# EAGLE design Mainboard (EAGLE 9.2.0)
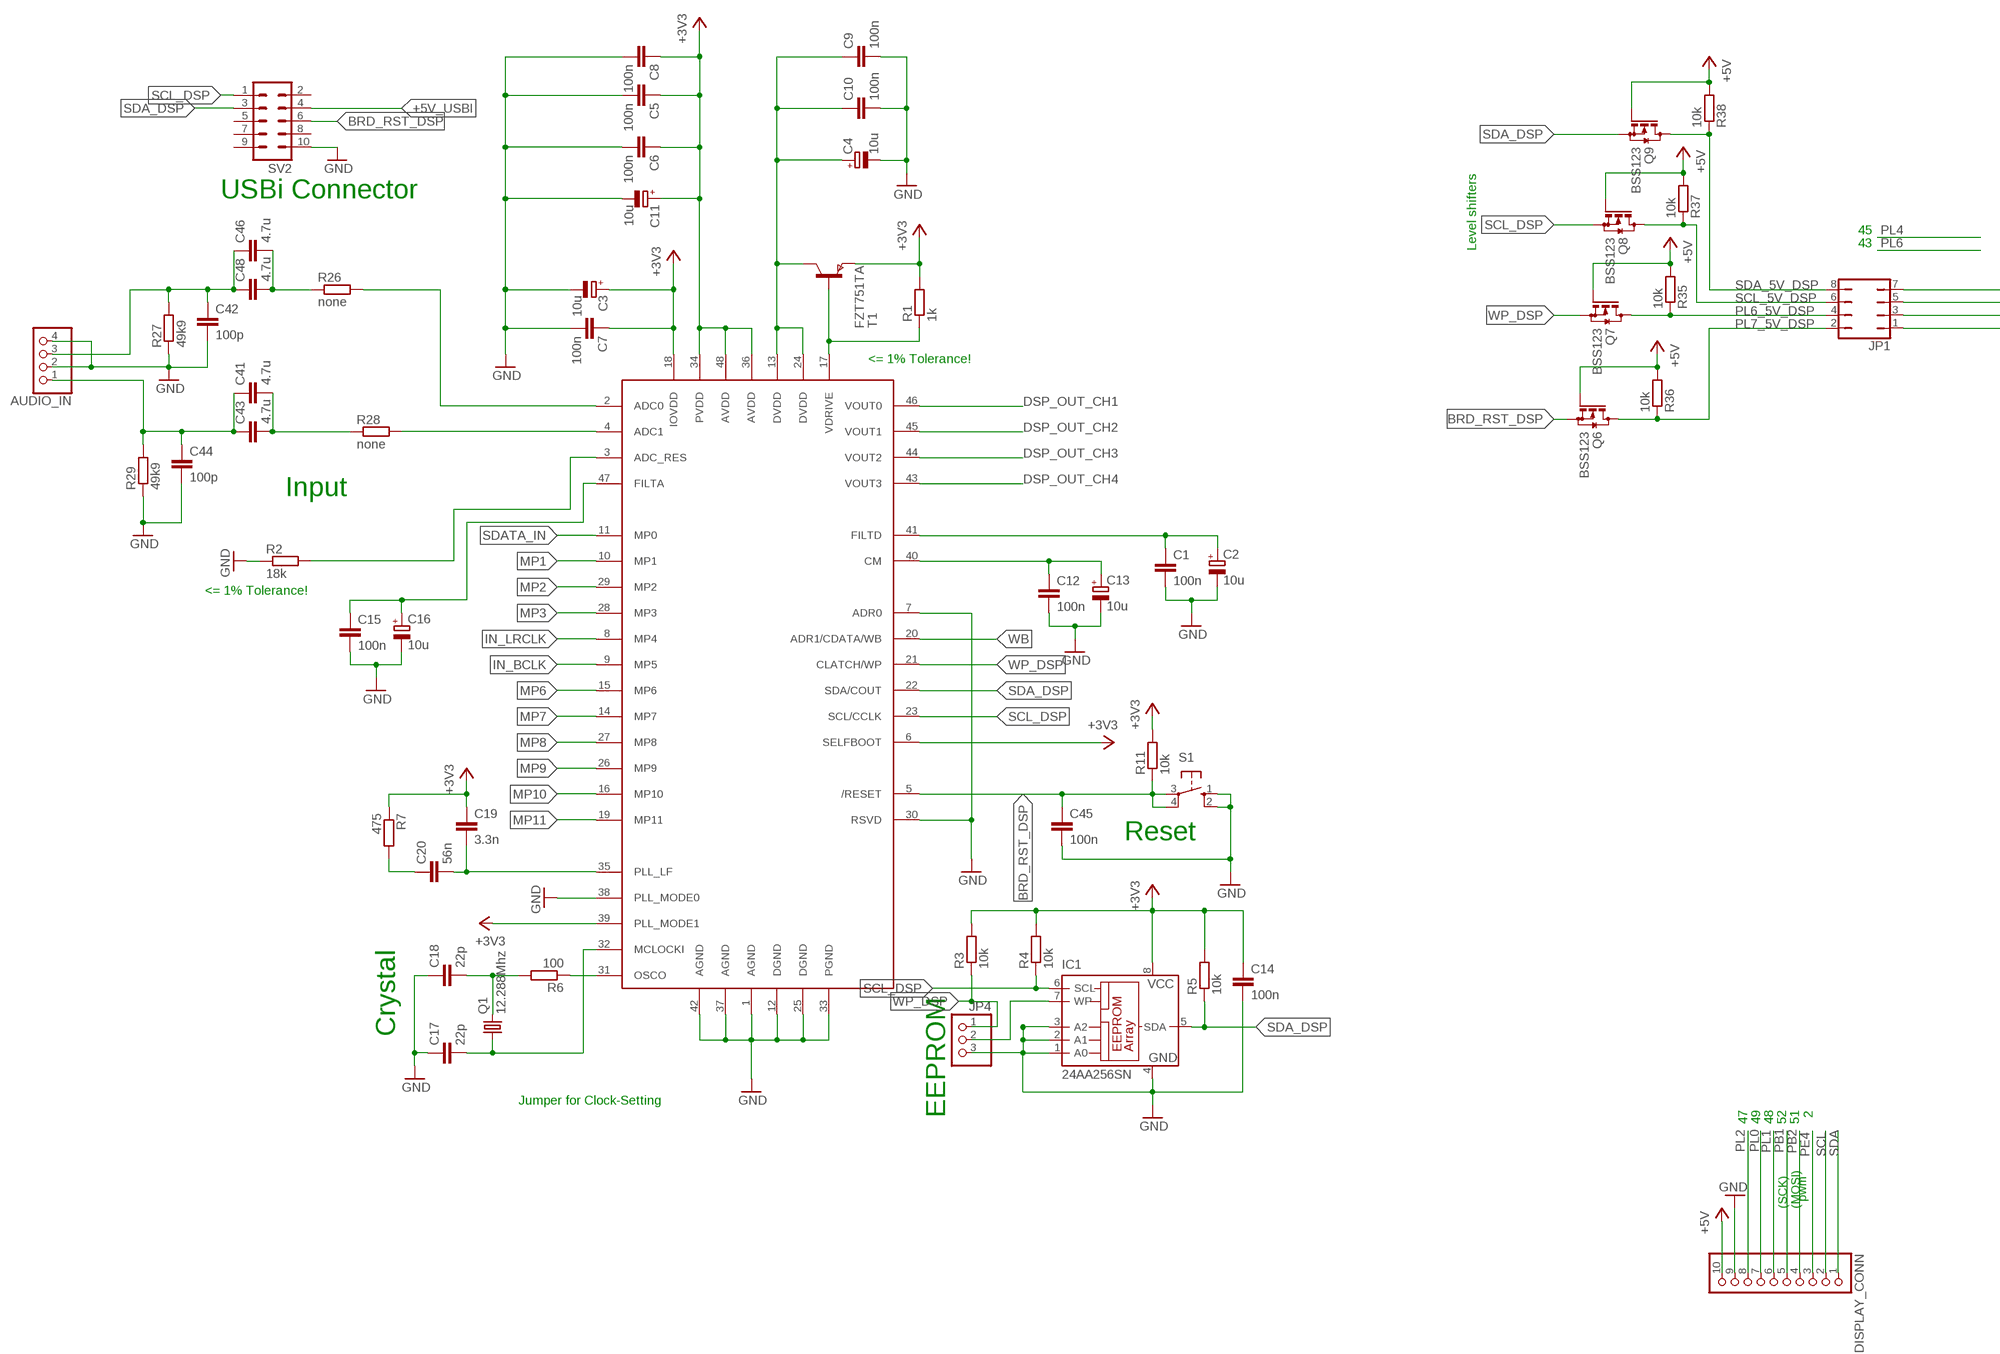
[diagram p0: schematic, sheet 1, part 1 of 3]
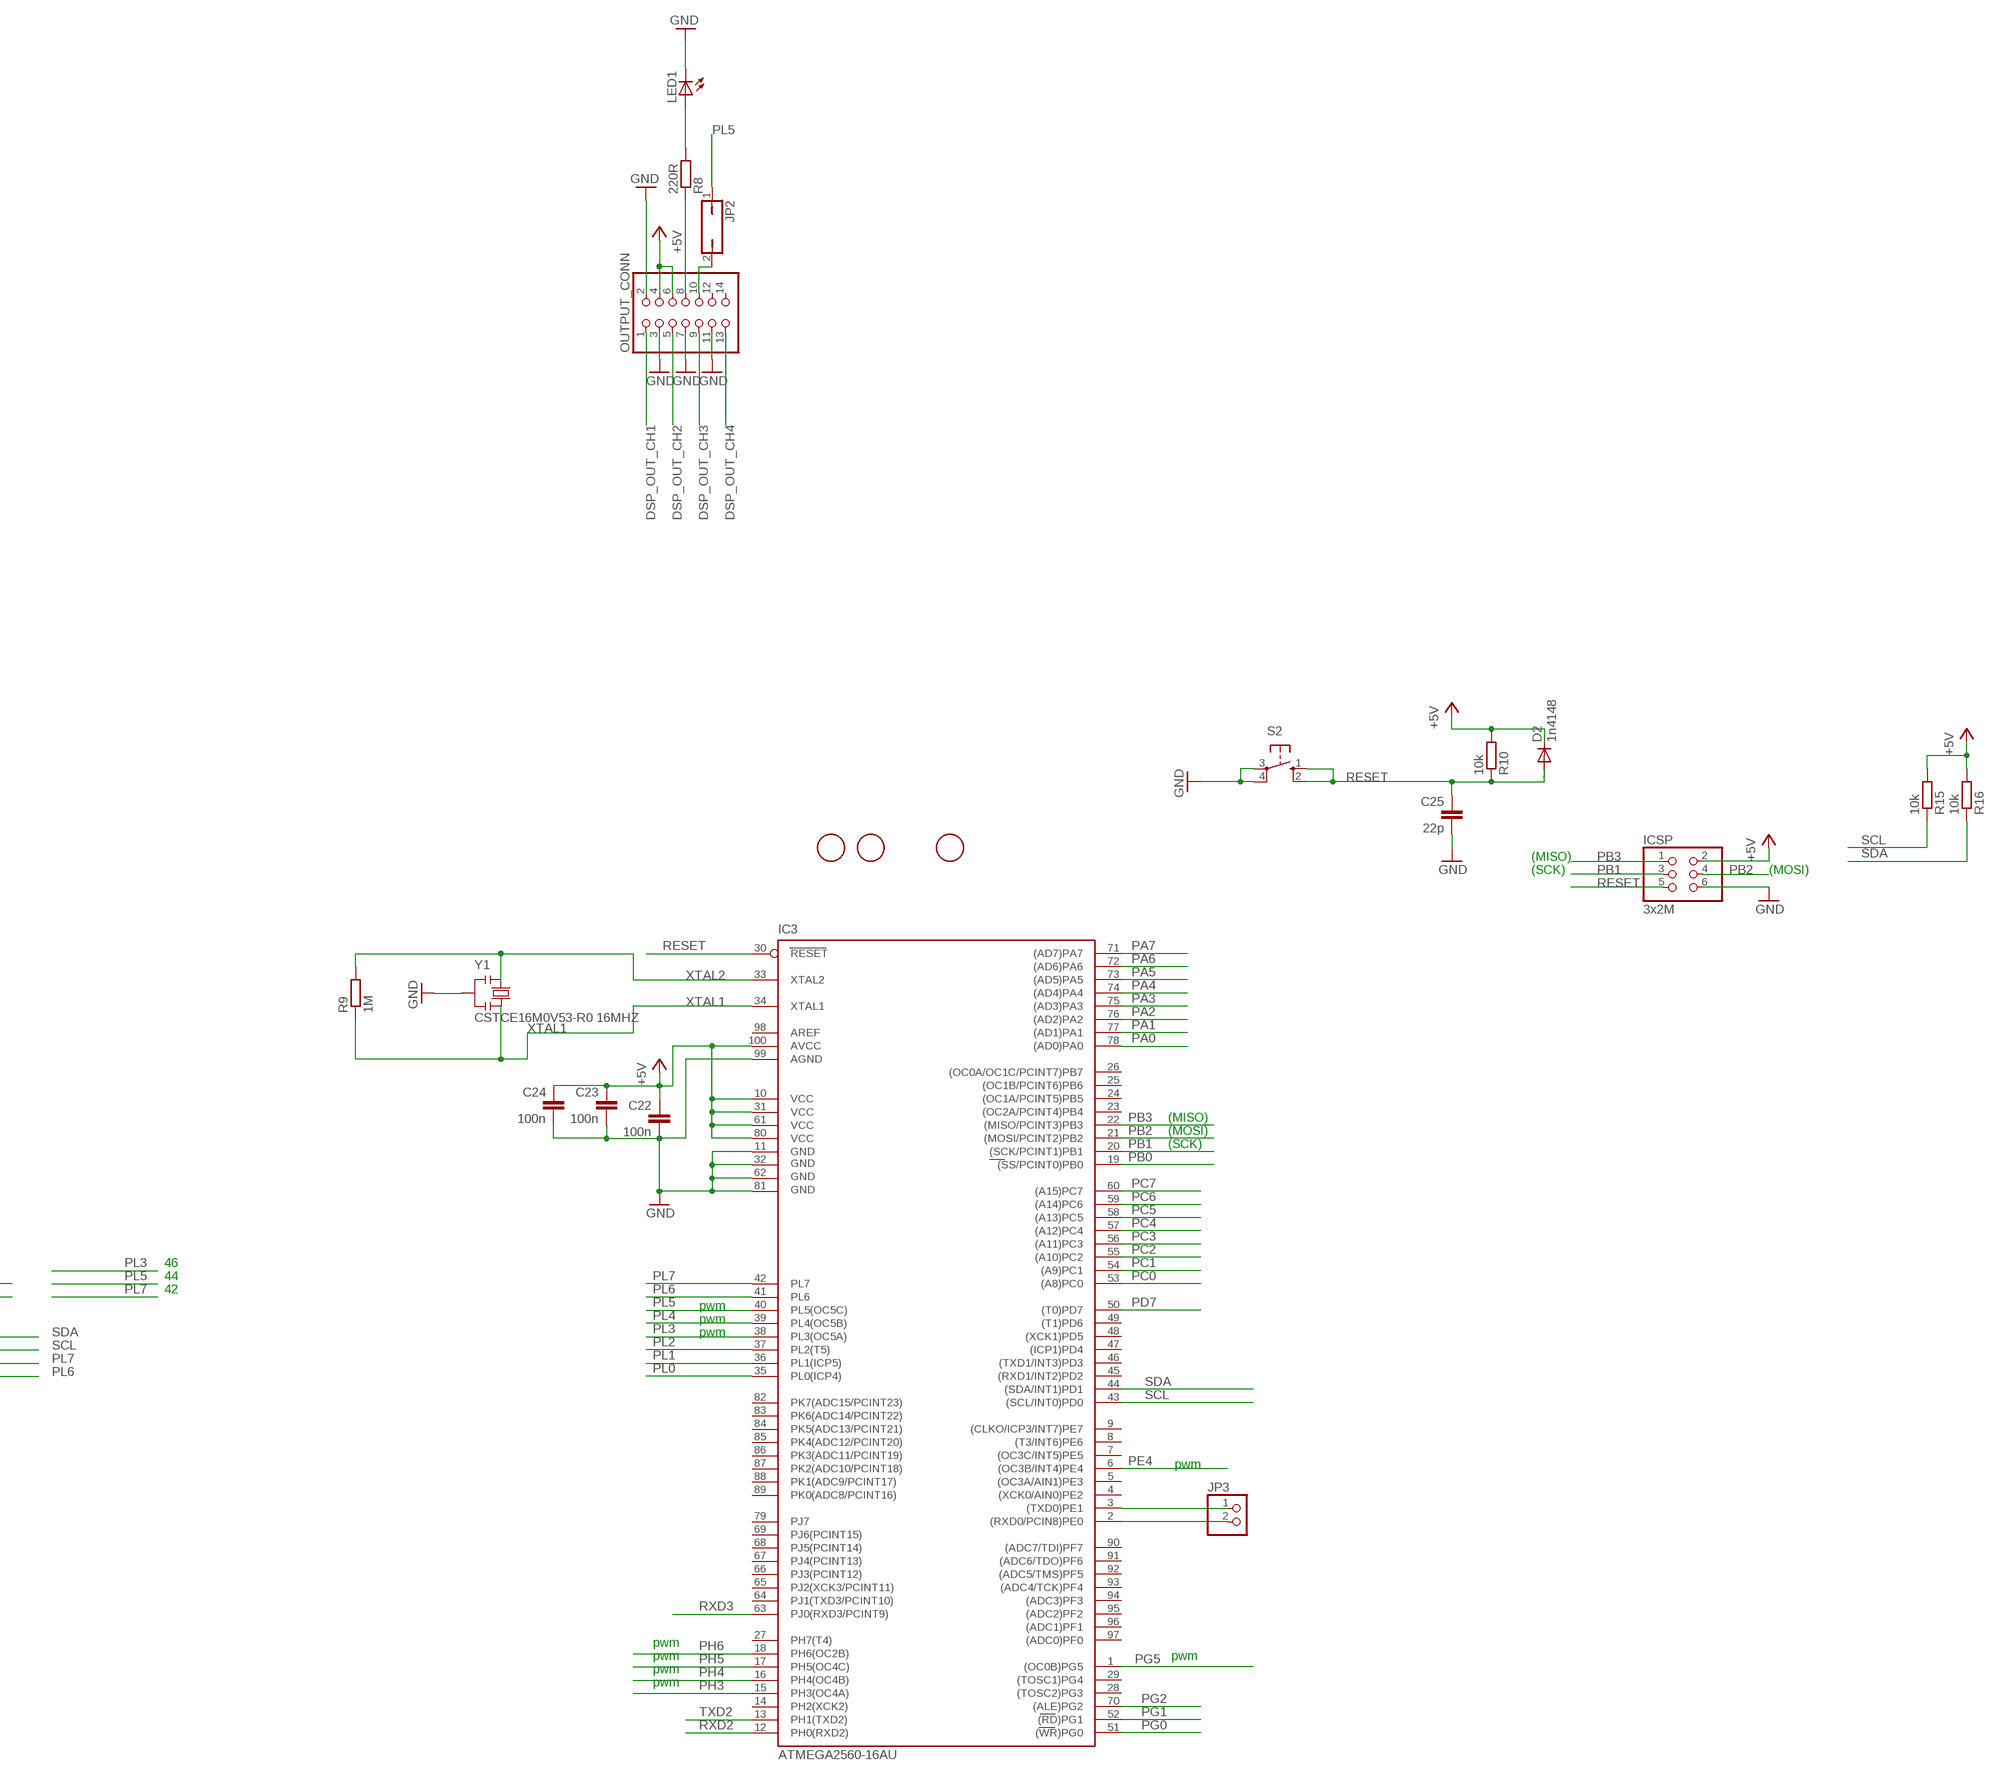
[diagram p1: schematic, sheet 1, part 2 of 3]
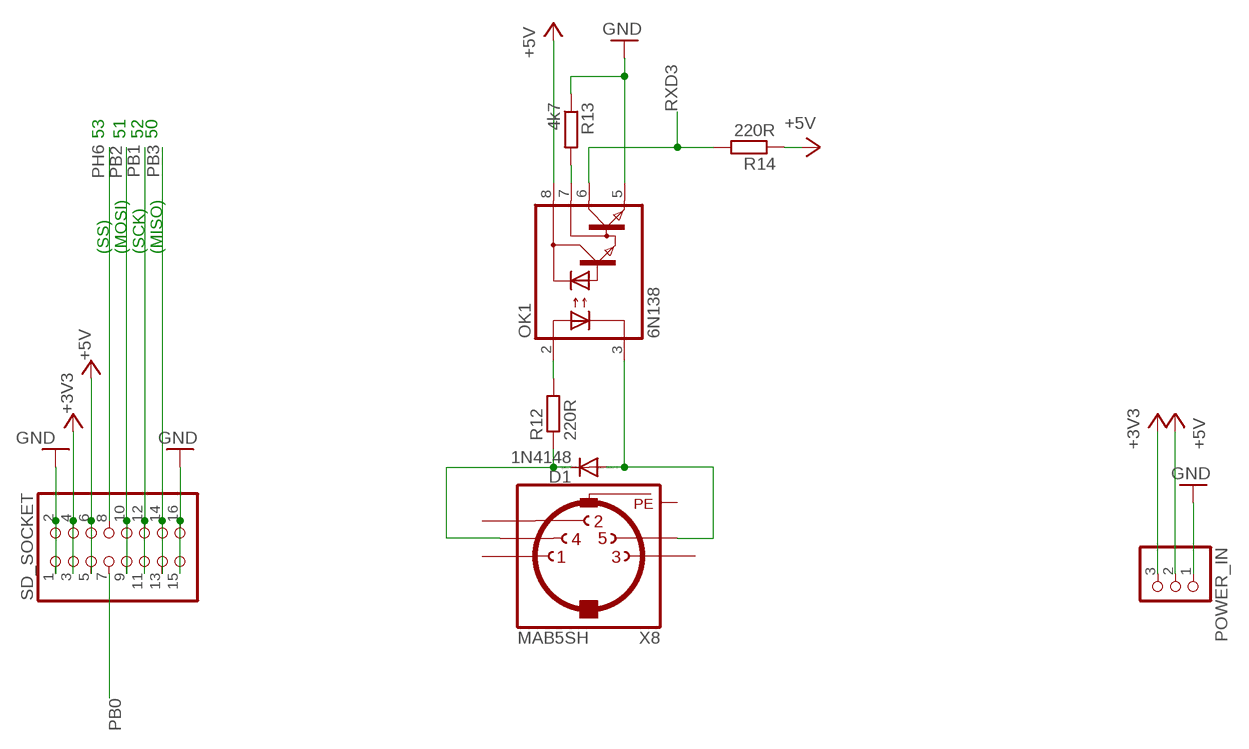
[diagram p2: schematic, sheet 1, part 3 of 3]

## Parts
AUDIO_IN  PINHD-1X4  [1X04]
C1  100n  C-EUC0805K  [C0805K]
C2  10u  CPOL-EUE1.8-4  [E1,8-4]
C3  10u  CPOL-EUE1.8-4  [E1,8-4]
C4  10u  CPOL-EUE1.8-4  [E1,8-4]
C5  100n  C-EUC0805K  [C0805K]
C6  100n  C-EUC0805K  [C0805K]
C7  100n  C-EUC0805K  [C0805K]
C8  100n  C-EUC0805K  [C0805K]
C9  100n  C-EUC0805K  [C0805K]
C10  100n  C-EUC0805K  [C0805K]
C11  10u  CPOL-EUE1.8-4  [E1,8-4]
C12  100n  C-EUC0805K  [C0805K]
C13  10u  CPOL-EUE1.8-4  [E1,8-4]
C14  100n  C-EUC0805K  [C0805K]
C15  100n  C-EUC0805K  [C0805K]
C16  10u  CPOL-EUE1.8-4  [E1,8-4]
C17  22p  C-EUC0805K  [C0805K]
C18  22p  C-EUC0805K  [C0805K]
C19  3.3n  C-EUC0805K  [C0805K]
C20  56n  C-EUC0805K  [C0805K]
C22  100n  C-EUC0805K  [C0805K]
C23  100n  C-EUC0805K  [C0805K]
C24  100n  C-EUC0805K  [C0805K]
C25  22p  C-EUC0805K  [C0805K]
C41  4.7u  C-EU050-075X075  [C050-075X075]
C42  100p  C-EUC0805K  [C0805K]
C43  4.7u  C-EU050-075X075  [C050-075X075]
C44  100p  C-EUC0805K  [C0805K]
C45  100n  C-EUC0805K  [C0805K]
C46  4.7u  C-EU050-075X075  [C050-075X075]
C48  4.7u  C-EU050-075X075  [C050-075X075]
D1  1N4148  CGRM4001-G  [SOD-123_MINI-SMA]
D2  1n4148  CGRM4001-G  [SOD-123_MINI-SMA]
DISPLAY_CONN  PINHD-1X10  [1X10]
FD1  FIDUCIALMOUNT  [FIDUCIA-MOUNT]
FD2  FIDUCIALMOUNT  [FIDUCIA-MOUNT]
FD4  FIDUCIALMOUNT  [FIDUCIA-MOUNT]
IC1  24AA256SN  [SO-08]
IC3  ATMEGA2560-16AU  ATMEGA25602560-16AU  [TQFP100]
ICSP  3x2M  PINHD-2X3  [2X03]
JP1  JP4Q  [JP4Q]
JP2  JP1Q  [JP1]
JP3  PINHD-1X2  [1X02]
JP4  PINHD-1X3  [1X03]
LED1  LED5MM  [LED5MM]
OK1  6N138  [DIL08]
OUTPUT_CONN  PINHD-2X7  [2X07]
POWER_IN  PINHD-1X3  [1X03]
Q1  12.288Mhz  CRYSTALHC49S  [HC49/S]
Q6  BSS123  [SOT23]
Q7  BSS123  [SOT23]
Q8  BSS123  [SOT23]
Q9  BSS123  [SOT23]
R1  1k  R-EU_R0805  [R0805]
R2  18k  R-EU_R0805  [R0805]
R3  10k  R-EU_R0805  [R0805]
R4  10k  R-EU_R0805  [R0805]
R5  10k  R-EU_R0805  [R0805]
R6  100  R-EU_R0805  [R0805]
R7  475  R-EU_R0805  [R0805]
R8  220R  R-EU_R0805  [R0805]
R9  1M  R-EU_R0805  [R0805]
R10  10k  R-EU_R0805  [R0805]
R11  10k  R-EU_R0805  [R0805]
R12  220R  R-EU_R0805  [R0805]
R13  4k7  R-EU_R0805  [R0805]
R14  220R  R-EU_R0805  [R0805]
R15  10k  R-EU_R0805  [R0805]
R16  10k  R-EU_R0805  [R0805]
R26  none  R-EU_R0805  [R0805]
R27  49k9  R-EU_R0805  [R0805]
R28  none  R-EU_R0805  [R0805]
R29  49k9  R-EU_R0805  [R0805]
R35  10k  R-EU_R0805  [R0805]
R36  10k  R-EU_R0805  [R0805]
R37  10k  R-EU_R0805  [R0805]
R38  10k  R-EU_R0805  [R0805]
S1  10-XX  [B3F-10XX]
S2  10-XX  [B3F-10XX]
SD_SOCKET  PINHD-2X8  [2X08]
SV2  ML10  [ML10]
T1  FZT751TA  FZT789A  [SOT223]
U$1  ADAU1701  [LQFP-48]
X8  MAB5SH  [MAB5SH]
Y1  CSTCE16M0V53-R0 16MHZ  RESONATORMU  [RESONATOR]

## Nets
1V8_DSP: C4.+ C9.1 C10.1 T1.2(C) T1.4(C) U$1.13(DVDD) U$1.24(DVDD)
+3V3: C3.+ C5.1 C6.1 C7.1 C8.1 C11.+ C14.1 C19.1 IC1.8(VCC) POWER_IN.3 R1.2 R3.2 R4.2 R5.2 R7.1 R11.2 SD_SOCKET.3 SD_SOCKET.4 T1.3(E) U$1.6(SELFBOOT) U$1.18(IOVDD) U$1.34(PVDD) U$1.36(AVDD) U$1.39(PLL_MODE1) U$1.48(AVDD)
+5V: C22.1 C23.1 C24.1 D2.C DISPLAY_CONN.10 IC3.10(VCC) IC3.31(VCC1) IC3.61(VCC2) IC3.80(VCC3) IC3.100(AVCC) ICSP.2 OK1.8(VCC) OUTPUT_CONN.4 OUTPUT_CONN.6 POWER_IN.2 Q6.1(G) Q7.1(G) Q8.1(G) Q9.1(G) R10.2 R14.1 R15.2 R16.2 R35.2 R36.2 R37.2 R38.2 SD_SOCKET.5 SD_SOCKET.6
+5V_USBI: SV2.4
ADC0: R28.2 U$1.4(ADC1)
BRD_RST_DSP: C45.1 Q6.2(S) R11.1 S1.3(P) S1.4(P1) SV2.6 U$1.5(/RESET)
CM: C12.1 C13.+ U$1.40(CM)
DSP_OUT_CH1: OUTPUT_CONN.1 U$1.46(VOUT0)
DSP_OUT_CH2: OUTPUT_CONN.5 U$1.45(VOUT1)
DSP_OUT_CH3: OUTPUT_CONN.9 U$1.44(VOUT2)
DSP_OUT_CH4: OUTPUT_CONN.13 U$1.43(VOUT3)
FILTA: C15.1 C16.+ U$1.47(FILTA)
FILTD: C1.1 C2.+ U$1.41(FILTD)
GND: AUDIO_IN.2 AUDIO_IN.4 C1.2 C2.- C3.- C4.- C5.2 C6.2 C7.2 C8.2 C9.2 C10.2 C11.- C12.2 C13.- C14.2 C15.2 C16.- C17.1 C18.1 C22.2 C23.2 C24.2 C25.2 C42.2 C44.2 C45.2 DISPLAY_CONN.9 IC1.1(A0) IC1.2(A1) IC1.3(A2) IC1.4(GND) IC3.11(GND) IC3.32(GND1) IC3.62(GND2) IC3.81(GND3) IC3.99(AGND) ICSP.6 JP4.3 LED1.K(C) OK1.5(GND) OUTPUT_CONN.2 OUTPUT_CONN.3 OUTPUT_CONN.7 OUTPUT_CONN.11 POWER_IN.1 R2.1 R13.1 R27.1 R29.1 S1.1(S) S1.2(S1) S2.3(P) S2.4(P1) SD_SOCKET.1 SD_SOCKET.2 SD_SOCKET.15 SD_SOCKET.16 SV2.10 U$1.1(AGND) U$1.7(ADR0) U$1.12(DGND) U$1.25(DGND) U$1.30(RSVD) U$1.33(PGND) U$1.37(AGND) U$1.38(PLL_MODE0) U$1.42(AGND) Y1.2
IN_BCLK: U$1.9(MP5)
IN_LRCLK: U$1.8(MP4)
MP1: U$1.10(MP1)
MP2: U$1.29(MP2)
MP3: U$1.28(MP3)
MP6: U$1.15(MP6)
MP7: U$1.14(MP7)
MP8: U$1.27(MP8)
MP9: U$1.26(MP9)
MP10: U$1.16(MP10)
MP11: U$1.19(MP11)
N$1: R2.2 U$1.3(ADC_RES)
N$2: R1.1 T1.1(B) U$1.17(VDRIVE)
N$3: C19.2 C20.2 U$1.35(PLL_LF)
N$4: OUTPUT_CONN.8 R8.1
N$5: C20.1 R7.2
N$6: C18.2 Q1.2 R6.2
N$7: C17.2 Q1.1 U$1.32(MCLOCKI)
N$8: R6.1 U$1.31(OSCO)
N$9: LED1.A R8.2
N$10: JP2.2 OUTPUT_CONN.10
N$11: IC3.3((TXD0)PE1) JP3.1
N$12: IC3.2((RXD0/PCIN8)PE0) JP3.2
N$13: OK1.2(A) R12.2
N$15: D1.C R12.1 X8.4
N$16: D1.A OK1.3(C) X8.5
N$17: OK1.7(VB) R13.2
N$30: C46.2 C48.2 R26.1
N$31: AUDIO_IN.3 C42.1 C46.1 C48.1 R27.2
N$34: AUDIO_IN.1 C41.1 C43.1 C44.1 R29.2
N$36: C41.2 C43.2 R28.1
N$40: R26.2 U$1.2(ADC0)
N$43: IC1.7(WP) JP4.2
PA0: IC3.78((AD0)PA0)
PA1: IC3.77((AD1)PA1)
PA2: IC3.76((AD2)PA2)
PA3: IC3.75((AD3)PA3)
PA4: IC3.74((AD4)PA4)
PA5: IC3.73((AD5)PA5)
PA6: IC3.72((AD6)PA6)
PA7: IC3.71((AD7)PA7)
PB0: IC3.19((SS/PCINT0)PB0) SD_SOCKET.7
PB1: DISPLAY_CONN.5 IC3.20((SCK/PCINT1)PB1) ICSP.3 SD_SOCKET.11 SD_SOCKET.12
PB2: DISPLAY_CONN.4 IC3.21((MOSI/PCINT2)PB2) ICSP.4 SD_SOCKET.9 SD_SOCKET.10
PB3: IC3.22((MISO/PCINT3)PB3) ICSP.1 SD_SOCKET.13 SD_SOCKET.14
PC0: IC3.53((A8)PC0)
PC1: IC3.54((A9)PC1)
PC2: IC3.55((A10)PC2)
PC3: IC3.56((A11)PC3)
PC4: IC3.57((A12)PC4)
PC5: IC3.58((A13)PC5)
PC6: IC3.59((A14)PC6)
PC7: IC3.60((A15)PC7)
PD7: IC3.50((T0)PD7)
PE4: DISPLAY_CONN.3 IC3.6((OC3B/INT4)PE4)
PG0: IC3.51((WR)PG0)
PG1: IC3.52((RD)PG1)
PG2: IC3.70((ALE)PG2)
PG5: IC3.1((OC0B)PG5)
PH3: IC3.15(PH3(OC4A))
PH4: IC3.16(PH4(OC4B))
PH5: IC3.17(PH5(OC4C))
PH6: IC3.18(PH6(OC2B)) SD_SOCKET.8
PL0: DISPLAY_CONN.7 IC3.35(PL0(ICP4))
PL1: DISPLAY_CONN.6 IC3.36(PL1(ICP5))
PL2: DISPLAY_CONN.8 IC3.37(PL2(T5))
PL3: IC3.38(PL3(OC5A))
PL4: IC3.39(PL4(OC5B))
PL5: IC3.40(PL5(OC5C)) JP2.1
PL6: IC3.41(PL6) JP1.1
PL6_5V_DSP: JP1.4 Q7.3(D) R35.1
PL7: IC3.42(PL7) JP1.3
PL7_5V_DSP: JP1.2 Q6.3(D) R36.1
RESET: C25.1 D2.A IC3.30(RESET) ICSP.5 R10.1 S2.1(S) S2.2(S1)
RXD2: IC3.12(PH0(RXD2))
RXD3: IC3.63(PJ0(RXD3/PCINT9)) OK1.6(VO) R14.2
SCL: DISPLAY_CONN.2 IC3.43((SCL/INT0)PD0) JP1.5 R15.1
SCL_5V_DSP: JP1.6 Q8.3(D) R37.1
SCL_DSP: IC1.6(SCL) Q8.2(S) R4.1 SV2.1 U$1.23(SCL/CCLK)
SDA: DISPLAY_CONN.1 IC3.44((SDA/INT1)PD1) JP1.7 R16.1
SDA_5V_DSP: JP1.8 Q9.3(D) R38.1
SDA_DSP: IC1.5(SDA) Q9.2(S) R5.1 SV2.3 U$1.22(SDA/COUT)
SDATA_IN: U$1.11(MP0)
TXD2: IC3.13(PH1(TXD2))
WB: U$1.20(ADR1/CDATA/WB)
WP_DSP: JP4.1 Q7.2(S) R3.1 U$1.21(CLATCH/WP)
XTAL1: IC3.34(XTAL1) R9.1 Y1.3
XTAL2: IC3.33(XTAL2) R9.2 Y1.1
Unconnected: IC3.4((XCK0/AIN0)PE2) IC3.5((OC3A/AIN1)PE3) IC3.7((OC3C/INT5)PE5) IC3.8((T3/INT6)PE6) IC3.9((CLKO/ICP3/INT7)PE7) IC3.14(PH2(XCK2)) IC3.23((OC2A/PCINT4)PB4) IC3.24((OC1A/PCINT5)PB5) IC3.25((OC1B/PCINT6)PB6) IC3.26((OC0A/OC1C/PCINT7)PB7) IC3.27(PH7(T4)) IC3.28((TOSC2)PG3) IC3.29((TOSC1)PG4) IC3.45((RXD1/INT2)PD2) IC3.46((TXD1/INT3)PD3) IC3.47((ICP1)PD4) IC3.48((XCK1)PD5) IC3.49((T1)PD6) IC3.64(PJ1(TXD3/PCINT10)) IC3.65(PJ2(XCK3/PCINT11)) IC3.66(PJ3(PCINT12)) IC3.67(PJ4(PCINT13)) IC3.68(PJ5(PCINT14)) IC3.69(PJ6(PCINT15)) IC3.79(PJ7) IC3.82(PK7(ADC15/PCINT23)) IC3.83(PK6(ADC14/PCINT22)) IC3.84(PK5(ADC13/PCINT21)) IC3.85(PK4(ADC12/PCINT20)) IC3.86(PK3(ADC11/PCINT19)) IC3.87(PK2(ADC10/PCINT18)) IC3.88(PK1(ADC9/PCINT17)) IC3.89(PK0(ADC8/PCINT16)) IC3.90((ADC7/TDI)PF7) IC3.91((ADC6/TDO)PF6) IC3.92((ADC5/TMS)PF5) IC3.93((ADC4/TCK)PF4) IC3.94((ADC3)PF3) IC3.95((ADC2)PF2) IC3.96((ADC1)PF1) IC3.97((ADC0)PF0) IC3.98(AREF) OUTPUT_CONN.12 OUTPUT_CONN.14 SV2.2 SV2.5 SV2.7 SV2.8 SV2.9 X8.1 X8.2 X8.3

## Notes on the sheet
- (MISO)
- (SCK) | (MOSI)
- (MISO)
- (MOSI)
- (SCK)
- USBi Connector
- 46
- 45 | 44
- Level shifters | 43 | 42
- pwm
- pwm
- pwm
- <= 1% Tolerance!
- pwm
- Input
- <= 1% Tolerance! | pwm
- pwm | pwm
- pwm
- pwm
- Reset
- 53 | 51 | 52 | 50
- Crystal
- (SS) | (MOSI) | (SCK) | (MISO)
- Jumper for Clock-Setting
- EEPROM | 2
- 47 | 49 | 48 | 52 | 51
- pwm
- (SCK) | (MOSI)

## Power pins joined to a net without a drawn wire
PE: X8.PE X8.PE@(PE)

## Library data of the parts
AUDIO_IN = pinhead:PINHD-1X4: PIN HEADER
C1 C5-C10 C12 C14 C15 C17-C20 C41-C46 C48 = rcl:C-EU: CAPACITOR, European symbol
C2-C4 C11 C13 C16 = rcl:CPOL-EU: POLARIZED CAPACITOR, European symbol
C22-C25 = SmartPrj:C-EU: CAPACITOR, European symbol
D1 D2 = diode:CGRM400*-G: Molded plasitc,JEDEC SOD-123/Mini SMA Source: Comchip CGRM4001-G.pdf
DISPLAY_CONN = pinhead:PINHD-1X10: PIN HEADER
FD1 FD2 FD4 = SmartPrj:FIDUCIALMOUNT
IC1 = microchip:24*: Serial EEPROM I2C; MPN: 24AA256T-I/SM; OC_FARNELL: 1579570; OC_NEWARK: 08N6838
IC3 = SmartPrj:ATMEGA2560: MICROCONTROLLER 64/128/256 Kbytes FLASH 4 Kbytes EEPROM 8 Kbytes SRAM 86 General Purpose I/O pins 12-channels16-bit PWM 4 x Serial USARTs 16-channels 10-bit A/D
ICSP = SmartPrj:PINHD-2X3: PIN HEADER
JP1 = jumper:JP4Q: JUMPER
JP2 = jumper:JP1Q: JUMPER
JP3 = pinhead:PINHD-1X2: PIN HEADER
JP4 POWER_IN = pinhead:PINHD-1X3: PIN HEADER
LED1 = led:LED: LED OSRAM: - CHIPLED LG R971, LG N971, LY N971, LG Q971, LY Q971, LO R971, LY R971 LH N974, LH R974 LS Q976, LO Q976, LY Q976 LO Q996 - Hyper CHIPLED LW Q18S LB Q993, LB Q99A, LB R99A - SideLED LS A670, LO A670, LY A670, LG A670, LP A670 LB A673, LV A673, LT A673, LW A673 LH A674 LY A675 LS A676, LA A676, LO A676, LY A676, LW A676 LS A679, LY A679, LG A679 - Hyper Micro SIDELED® LS Y876, LA Y876, LO Y876, LY Y876 LT Y87S - SmartLED LW L88C, LW L88S LB L89C, LB L89S, LG L890 LS L89K, LO L89K, LY L89K LS L896, LA L896, LO L896, LY L896 - TOPLED LS T670, LO T670, LY T670, LG T670, LP T670 LSG T670, LSP T670, LSY T670, LOP T670, LYG T670 LG T671, LOG T671, LSG T671 LB T673, LV T673, LT T673, LW T673 LH T674 LS T676, LA T676, LO T676, LY T676, LB T676, LH T676, LSB T676, LW T676 LB T67C, LV T67C, LT T67C, LS T67K, LO T67K, LY T67K, LW E67C LS E67B, LA E67B, LO E67B, LY E67B, LB E67C, LV E67C, LT E67C LW T67C LS T679, LY T679, LG T679 LS T770, LO T770, LY T770, LG T770, LP T770 LB T773, LV T773, LT T773, LW T773 LH T774 LS E675, LA E675, LY E675, LS T675 LS T776, LA T776, LO T776, LY T776, LB T776 LHGB T686 LT T68C, LB T68C - Hyper Mini TOPLED® LB M676 - Mini TOPLED Santana® LG M470 LS M47K, LO M47K, LY M47K Source: http://www.osram.convergy.de LUXEON: - LUMILED® LXK2-PW12-R00, LXK2-PW12-S00, LXK2-PW14-U00, LXK2-PW14-V00 LXK2-PM12-R00, LXK2-PM12-S00, LXK2-PM14-U00 LXK2-PE12-Q00, LXK2-PE12-R00, LXK2-PE12-S00, LXK2-PE14-T00, LXK2-PE14-U00 LXK2-PB12-K00, LXK2-PB12-L00, LXK2-PB12-M00, LXK2-PB14-N00, LXK2-PB14-P00, LXK2-PB14-Q00 LXK2-PR12-L00, LXK2-PR12-M00, LXK2-PR14-Q00, LXK2-PR14-R00 LXK2-PD12-Q00, LXK2-PD12-R00, LXK2-PD12-S00 LXK2-PH12-R00, LXK2-PH12-S00 LXK2-PL12-P00, LXK2-PL12-Q00, LXK2-PL12-R00 Source: www.luxeon.com KINGBRIGHT: KA-3528ASYC Source: www.kingbright.com
OK1 = optocoupler:6N138: MOTOROLA OPTO COUPLER; MF: VISHAY/TELEFUNKEN; MPN: 6N138; OC_FARNELL: 9860150; OC_NEWARK: 35K5294
OUTPUT_CONN = pinhead:PINHD-2X7: PIN HEADER
Q1 = crystal:CRYSTAL: CRYSTAL; OC_FARNELL: 1667008; OC_NEWARK: unknown
Q6-Q9 = transistor-small-signal:BSS123: N-CHANNEL MOS FET
R1-R8 R10-R16 R26-R29 R35-R38 = rcl:R-EU_: RESISTOR, European symbol
R9 = SmartPrj:R-EU_: RESISTOR, European symbol
S1 S2 = switch-omron:10-XX: OMRON SWITCH; MPN: B3F-1000; OC_FARNELL: 176432; OC_NEWARK: 36M3542
SD_SOCKET = pinhead:PINHD-2X8: PIN HEADER
SV2 = con-harting-ml:ML10: HARTING; OC_FARNELL: unknown; OC_NEWARK: unknown
T1 = zetex:FZT789A: PNP TRANSISTOR; MPN: FZT789A; OC_FARNELL: 9526633; OC_NEWARK: 97K0407
U$1 = analog-devices_2:ADAU1701
X8 = con-hirschmann:MAB5SH: Female CONNECTOR 5 pins 90 deg. with shield, horizontal (DIN 41524); OC_FARNELL: 809883; OC_NEWARK: unknown
Y1 = SmartPrj:RESONATOR

## Net classes
0 default: width 0.203 mm, drill 0.406 mm, clearance 0.203 mm
2 gnd: width 0.305 mm, drill 0.406 mm, clearance 0.203 mm
3 power usb: width 0.508 mm, drill 0.406 mm, clearance 0.203 mm

## Board
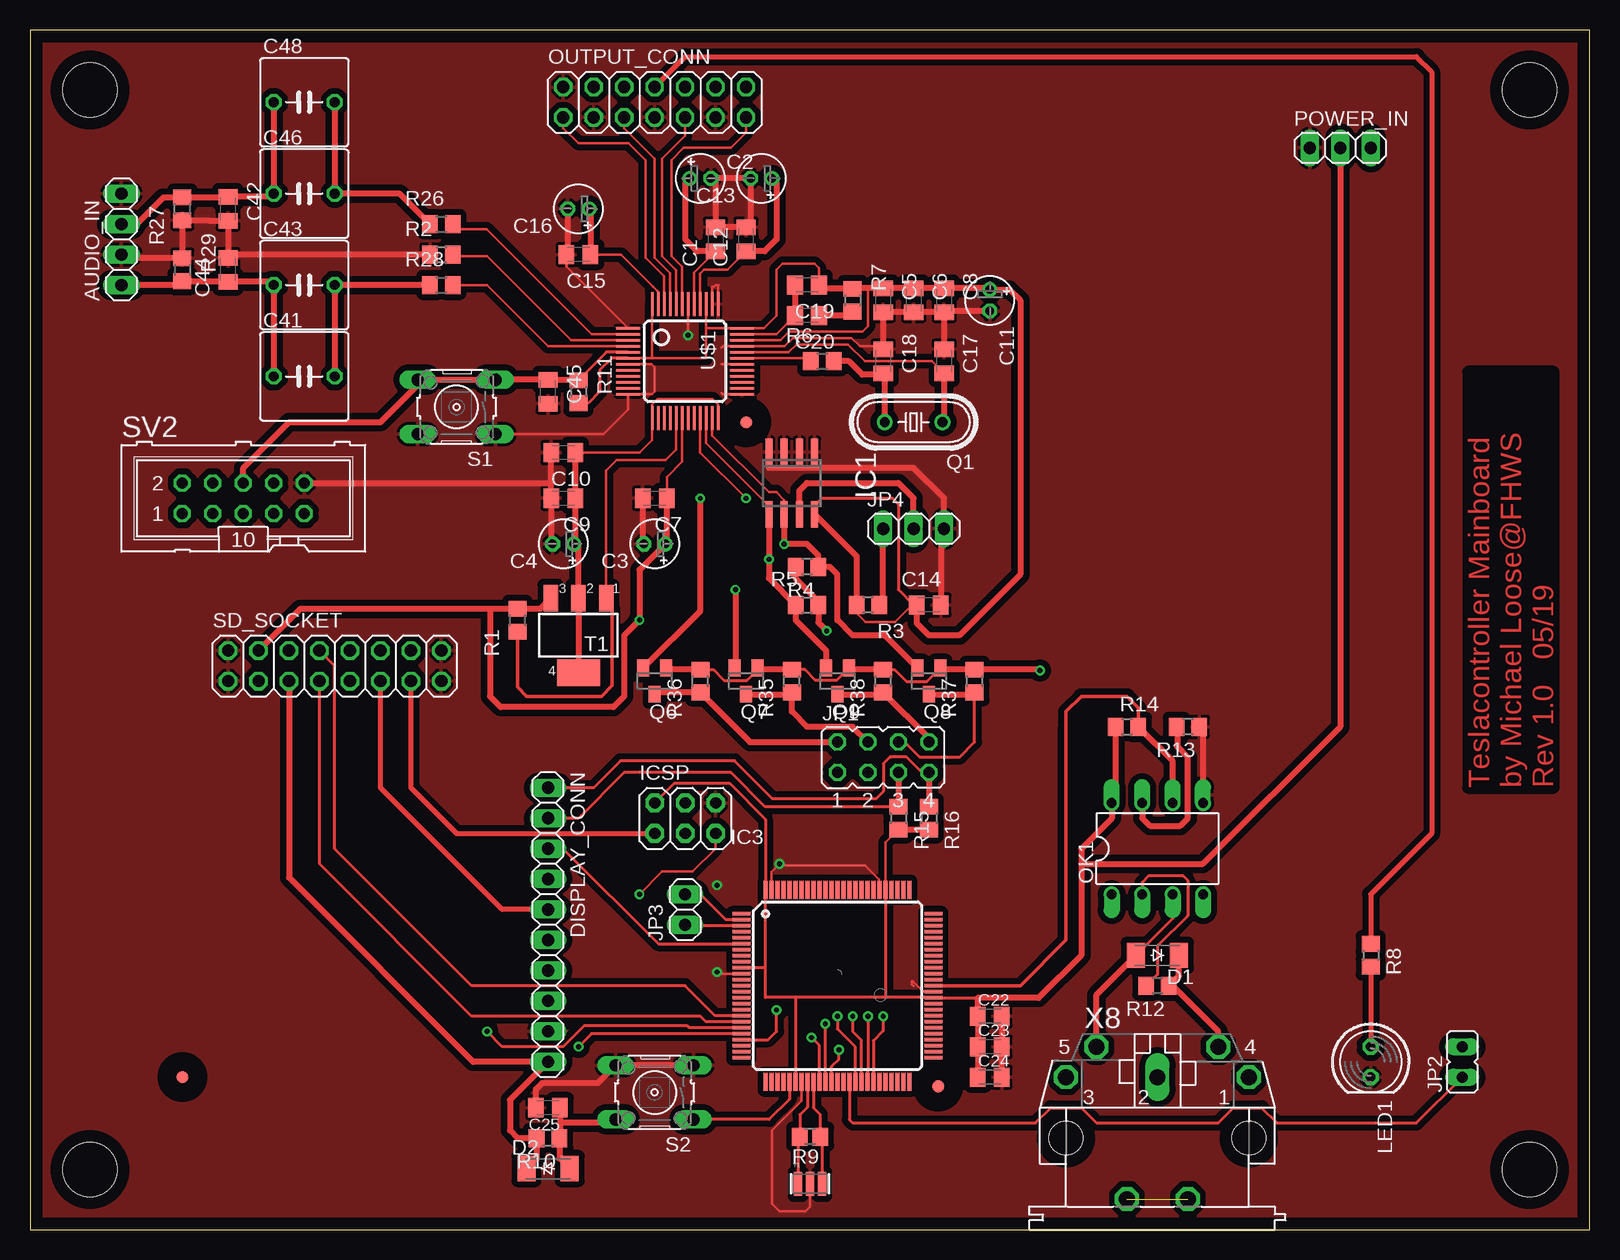
[diagram p3: board, top side]
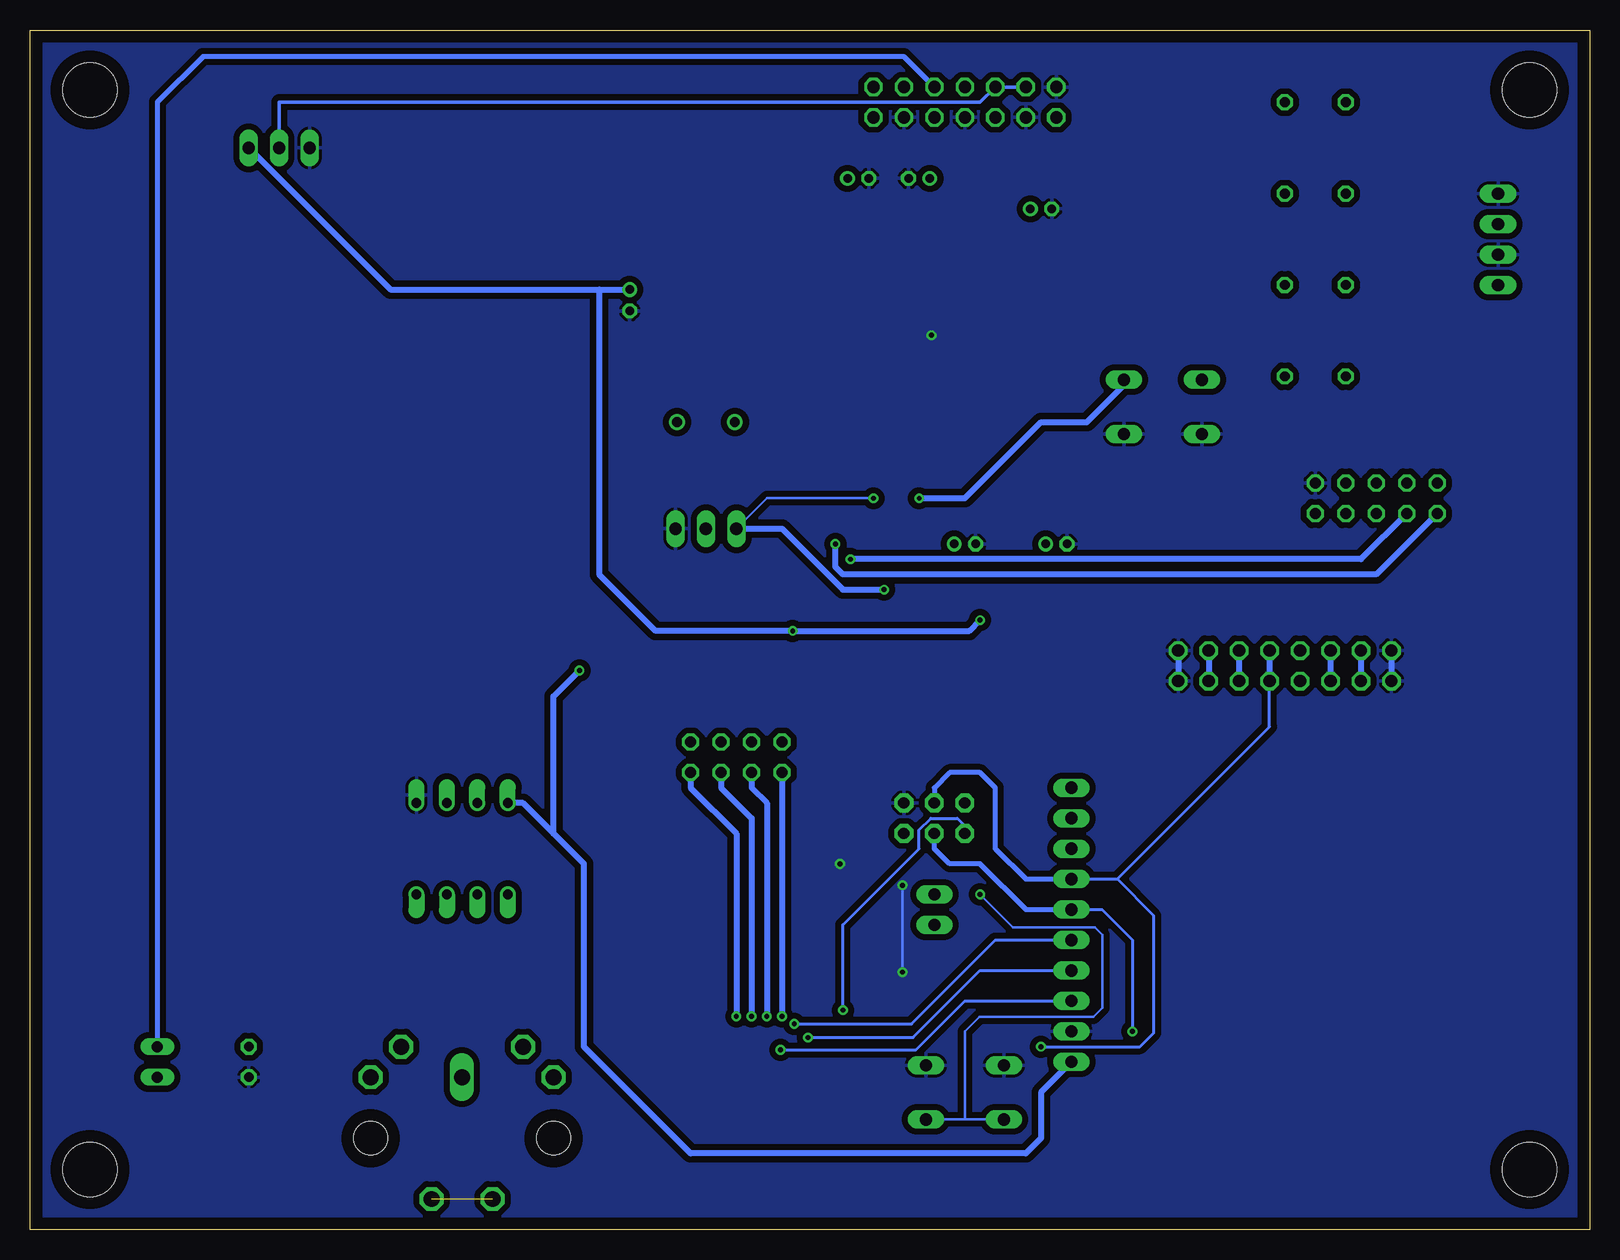
[diagram p4: board, bottom side, seen from below]

Size 130 x 100 mm. Coordinates in mm from the lower left corner, seen from the top.
Outline: 0,0 130,0 130,100 0,100 0,0
Copper layers (1*16): Top 0.035mm / dielectric 1.5mm / Bottom 0.035mm
Design rules "default *": minimum track width 6mil, minimum drill 0.35mm, track to track 6mil, track to pad 6mil, pad to pad 6mil, via to via 6mil, smd to smd 6mil, copper to edge 40mil, drill to drill 6mil, minimum pad ring 10mil, minimum via ring 8mil, stop-mask expansion 4mil, vias tented up to drill 0mil, thermal gap 10mil
Holes 4.5 mm at 5,5 125,5 125,95 5,95

### Footprints (pad centres in the part's own frame; a part is rotated, then mirrored left to right if it is on the bottom)
1X04 = drill 1.016 long: 1 -3.81,0; 2 -1.27,0; 3 1.27,0; 4 3.81,0
C0805K = smd 1.3 x 1.6: 1 -1,0; 2 1,0
E1,8-4 = drill 0.711 pad 1.168: + -0.889,0 | drill 0.711 pad 1.168 octagon: - 0.889,0
C050-075X075 = drill 0.813 octagon: 1 -2.54,0; 2 2.54,0
SOD-123_MINI-SMA = smd 1.5 x 2.1: A 1.8,0; C -1.8,0
1X10 = drill 1.016 long: 1 -11.43,0; 2 -8.89,0; 3 -6.35,0; 4 -3.81,0; 5 -1.27,0; 6 1.27,0; 7 3.81,0; 8 6.35,0; 9 8.89,0; 10 11.43,0
FIDUCIA-MOUNT = smd 1.016 x 1.016: P$1 0,0
SO-08 = smd 0.6 x 2.2: 1 -1.905,-2.6; 2 -0.635,-2.6; 3 0.635,-2.6; 4 1.905,-2.6; 5 1.905,2.6; 6 0.635,2.6; 7 -0.635,2.6; 8 -1.905,2.6
TQFP100 = smd 1.5 x 0.3: 1 -8,6; 2 -8,5.5; 3 -8,5; 4 -8,4.5; 5 -8,4; 6 -8,3.5; 7 -8,3; 8 -8,2.5; 9 -8,2; 10 -8,1.5; 11 -8,1; 12 -8,0.5; 13 -8,0; 14 -8,-0.5; 15 -8,-1; 16 -8,-1.5; 17 -8,-2; 18 -8,-2.5; 19 -8,-3; 20 -8,-3.5; 21 -8,-4; 22 -8,-4.5; 23 -8,-5; 24 -8,-5.5; 25 -8,-6; 51 8,-6; 52 8,-5.5; 53 8,-5; 54 8,-4.5; 55 8,-4; 56 8,-3.5; 57 8,-3; 58 8,-2.5; 59 8,-2; 60 8,-1.5; 61 8,-1; 62 8,-0.5; 63 8,0; 64 8,0.5; 65 8,1; 66 8,1.5; 67 8,2; 68 8,2.5; 69 8,3; 70 8,3.5; 71 8,4; 72 8,4.5; 73 8,5; 74 8,5.5; 75 8,6 | smd 0.3 x 1.5: 26 -6,-8; 27 -5.5,-8; 28 -5,-8; 29 -4.5,-8; 30 -4,-8; 31 -3.5,-8; 32 -3,-8; 33 -2.5,-8; 34 -2,-8; 35 -1.5,-8; 36 -1,-8; 37 -0.5,-8; 38 0,-8; 39 0.5,-8; 40 1,-8; 41 1.5,-8; 42 2,-8; 43 2.5,-8; 44 3,-8; 45 3.5,-8; 46 4,-8; 47 4.5,-8; 48 5,-8; 49 5.5,-8; 50 6,-8; 76 6,8; 77 5.5,8; 78 5,8; 79 4.5,8; 80 4,8; 81 3.5,8; 82 3,8; 83 2.5,8; 84 2,8; 85 1.5,8; 86 1,8; 87 0.5,8; 88 0,8; 89 -0.5,8; 90 -1,8; 91 -1.5,8; 92 -2,8; 93 -2.5,8; 94 -3,8; 95 -3.5,8; 96 -4,8; 97 -4.5,8; 98 -5,8; 99 -5.5,8; 100 -6,8
2X03 = drill 0.95 pad 1.55 octagon: 1 -2.54,-1.27; 2 -2.54,1.27; 3 0,-1.27; 4 0,1.27; 5 2.54,-1.27; 6 2.54,1.27
JP4Q = drill 0.914 octagon: 1 -3.81,-1.27; 2 -3.81,1.27; 3 -1.27,-1.27; 4 -1.27,1.27; 5 1.27,-1.27; 6 1.27,1.27; 7 3.81,-1.27; 8 3.81,1.27
JP1 = drill 0.914 long: 1 0,-1.27; 2 0,1.27
1X02 = drill 1.016 long: 1 -1.27,0; 2 1.27,0
1X03 = drill 1.016 long: 1 -2.54,0; 2 0,0; 3 2.54,0
LED5MM = drill 0.813 octagon: A -1.27,0; K 1.27,0
DIL08 = drill 0.813 offset: 1 -3.81,-3.81; 2 -1.27,-3.81; 3 1.27,-3.81; 4 3.81,-3.81; 5 3.81,3.81; 6 1.27,3.81; 7 -1.27,3.81; 8 -3.81,3.81
2X07 = drill 1.016 octagon: 1 -7.62,-1.27; 2 -7.62,1.27; 3 -5.08,-1.27; 4 -5.08,1.27; 5 -2.54,-1.27; 6 -2.54,1.27; 7 0,-1.27; 8 0,1.27; 9 2.54,-1.27; 10 2.54,1.27; 11 5.08,-1.27; 12 5.08,1.27; 13 7.62,-1.27; 14 7.62,1.27
HC49/S = drill 0.813: 1 -2.413,0; 2 2.413,0
SOT23 = smd 1 x 1.4: 1 -0.95,-1.1; 2 0.95,-1.1; 3 0,1.1
R0805 = smd 1.3 x 1.5: 1 -0.95,0; 2 0.95,0
R0805' = smd 1.3 x 1.5: 1 -0.85,0; 2 0.85,0
B3F-10XX = drill 1.016 long: 1 -3.251,2.261; 2 3.251,2.261; 3 -3.251,-2.261; 4 3.251,-2.261
2X08 = drill 1.016 octagon: 1 -8.89,-1.27; 2 -8.89,1.27; 3 -6.35,-1.27; 4 -6.35,1.27; 5 -3.81,-1.27; 6 -3.81,1.27; 7 -1.27,-1.27; 8 -1.27,1.27; 9 1.27,-1.27; 10 1.27,1.27; 11 3.81,-1.27; 12 3.81,1.27; 13 6.35,-1.27; 14 6.35,1.27; 15 8.89,-1.27; 16 8.89,1.27
ML10 = drill 0.914 octagon: 1 -5.08,-1.27; 2 -5.08,1.27; 3 -2.54,-1.27; 4 -2.54,1.27; 5 0,-1.27; 6 0,1.27; 7 2.54,-1.27; 8 2.54,1.27; 9 5.08,-1.27; 10 5.08,1.27
SOT223 = smd 1.219 x 2.235: 1 -2.311,-3.099; 2 0,-3.099; 3 2.311,-3.099 | smd 3.6 x 2.2: 4 0,3.099
LQFP-48 = smd 0.2 x 2: 1 -2.75,-4.75; 2 -2.25,-4.75; 3 -1.75,-4.75; 4 -1.25,-4.75; 5 -0.75,-4.75; 6 -0.25,-4.75; 7 0.25,-4.75; 8 0.75,-4.75; 9 1.25,-4.75; 10 1.75,-4.75; 11 2.25,-4.75; 12 2.75,-4.75; 25 2.75,4.75; 26 2.25,4.75; 27 1.75,4.75; 28 1.25,4.75; 29 0.75,4.75; 30 0.25,4.75; 31 -0.25,4.75; 32 -0.75,4.75; 33 -1.25,4.75; 34 -1.75,4.75; 35 -2.25,4.75; 36 -2.75,4.75 | smd 2 x 0.2: 13 4.75,-2.75; 14 4.75,-2.25; 15 4.75,-1.75; 16 4.75,-1.25; 17 4.75,-0.75; 18 4.75,-0.25; 19 4.75,0.25; 20 4.75,0.75; 21 4.75,1.25; 22 4.75,1.75; 23 4.75,2.25; 24 4.75,2.75; 37 -4.75,2.75; 38 -4.75,2.25; 39 -4.75,1.75; 40 -4.75,1.25; 41 -4.75,0.75; 42 -4.75,0.25; 43 -4.75,-0.25; 44 -4.75,-0.75; 45 -4.75,-1.25; 46 -4.75,-1.75; 47 -4.75,-2.25; 48 -4.75,-2.75
MAB5SH = drill 1.321 octagon: 1 7.62,5.08; 3 -7.62,5.08; 4 5.08,7.62; 5 -5.08,7.62; PE -2.54,-5.08; PE@ 2.54,-5.08 | drill 1.321 long: 2 0,5.08 | hole 2.794: 7.62,0; -7.62,0
RESONATOR = smd 0.7 x 2: 1 -1,0; 2 0,0; 3 1,0

### Placement (x,y rotation side)
AUDIO_IN  7.62,82.55 90 top
C1  57.15,82.55 90 top
C2  55.88,87.63 0 top
C3  52.07,57.15 180 top
C4  44.45,57.15 180 top
C5  71.12,77.47 270 top
C6  73.66,77.47 270 top
C7  52.07,60.96 180 top
C8  76.2,77.47 270 top
C9  44.45,60.96 180 top
C10  44.45,64.77 180 top
C11  80.01,77.47 270 top
C12  59.69,82.55 90 top
C13  60.96,87.63 180 top
C14  74.93,52.07 0 top
C15  45.72,81.28 180 top
C16  45.72,85.09 180 top
C17  76.2,72.39 270 top
C18  71.12,72.39 270 top
C19  64.77,78.74 180 top
C20  64.77,76.2 180 top
C22  80.01,17.78 0 top
C23  80.01,15.24 0 top
C24  80.01,12.7 0 top
C25  43.18,10.16 180 top
C41  22.86,71.12 0 top
C42  16.51,85.09 270 top
C43  22.86,78.74 0 top
C44  16.51,80.01 90 top
C45  43.18,69.85 270 top
C46  22.86,86.36 0 top
C48  22.86,93.98 0 top
D1  93.98,22.86 180 top
D2  43.18,5.08 0 top
DISPLAY_CONN  43.18,25.4 270 top
FD1  59.69,67.31 0 top
FD2  75.69,11.94 0 top
FD4  12.7,12.7 0 top
IC1  63.5,62.23 180 top
IC3  67.31,20.32 0 top
ICSP  54.61,34.29 0 top
JP1  71.12,39.37 0 top
JP2  119.38,13.97 0 top
JP3  54.61,26.67 90 top
JP4  73.66,58.42 0 top
LED1  111.76,13.97 270 top
OK1  93.98,31.75 0 top
OUTPUT_CONN  52.07,93.98 0 top
POWER_IN  109.22,90.17 0 top
Q1  73.66,67.31 180 top
Q6  52.07,45.72 180 top
Q7  59.69,45.72 180 top
Q8  74.93,45.72 180 top
Q9  67.31,45.72 180 top
R1  40.64,50.8 90 top
R2  34.29,81.28 0 top
R3  69.85,52.07 180 top
R4  64.77,55.24 180 top
R5  64.77,52.07 0 top
R6  66.04,72.39 0 top
R7  68.58,77.47 270 top
R8  111.76,22.86 270 top
R9  1M  [R0805']  65.02,7.75 180 top
R10  43.18,7.62 180 top
R11  45.72,69.85 270 top
R12  93.98,20.32 180 top
R13  96.52,41.91 180 top
R14  91.44,41.91 0 top
R15  72.39,34.29 270 top
R16  74.93,34.29 270 top
R26  34.29,83.82 0 top
R27  12.7,85.09 90 top
R28  34.29,78.74 0 top
R29  12.7,80.01 270 top
R35  63.5,45.72 90 top
R36  55.88,45.72 90 top
R37  78.74,45.72 90 top
R38  71.12,45.72 90 top
S1  35.56,68.58 180 top
S2  52.07,11.43 180 top
SD_SOCKET  25.4,46.99 0 top
SV2  17.78,60.96 0 top
T1  45.72,49.53 180 top
U$1  54.61,72.39 270 top
X8  93.98,7.62 0 top
Y1  65.02,3.81 0 top

### Tracks (layer width: path | path; a pad name or v marks a point on that pad's centre or on a via)
1V8_DSP
  Top 0.203: C10.1 50.8,64.77 51.86,65.83 U$1.13 51.86,68.75 52.32,69.22 56.9,69.22 57.36,68.75 U$1.24
  Top 0.508: C10.1 C9.1 45.45,57.26 | 45.45,57.26 C4.+ | 45.45,57.26 45.72,56.99 T1.2 T1.4
+3V3  (via drill 0.41)
  Top 0.203: C19.1 65.77,80.15 65.41,80.52 62.74,80.52 62.23,80.01 62.23,76.2 61.17,75.14 U$1.36 56.36,75.14 | U$1.34 62.58,74.14 63.29,74.85 69.39,74.85 69.85,75.31 69.85,78.47 | U$1.18 54.36,64.01 53.09,62.74 53.09,60.98 C7.1 | 56.36,75.14 U$1.39 | U$1.6 51.86,72.64 | 51.86,72.64 56.36,72.64 56.36,75.14 | U$1.48 51.86,72.64 | C14.1 73.52,52.07 72.08,50.63 69.64,50.63 68.9,51.38 R3.2
  Top 0.254: IC1.8 65.41,60.33 66.04,60.96 71.88,60.96 72.39,60.45 72.39,53.34 73.66,52.07 C14.1 | U$1.6 48.51,72.64 47.5,71.63 47.5,69.85 46.55,68.9 R11.2
  Top 0.508: C19.1 66.09,78.42 R7.1 68.63,78.47 69.85,78.47 C5.1 C6.1 C8.1 79.9,78.47 C11.+ 81.66,78.36 82.55,77.47 82.55,54.61 77.47,49.53 74.93,49.53 73.93,50.53 C14.1 | T1.3 42.53,51.75 R1.2 38.35,51.75 | C7.1 53.07,57.26 C3.+ 50.8,54.99 v50.8,50.8 49.53,49.53 49.53,44.45 48.64,43.56 39.24,43.56 38.35,44.45 38.35,51.75 | IC1.8 68.9,56.13 R3.2 | 38.35,51.75 22.54,51.75 SD_SOCKET.4 | R4.2 63.82,54.29 66.04,52.07 R5.2 65.72,50.61 v66.42,49.91
  Bottom 0.508: SD_SOCKET.4 SD_SOCKET.3 | POWER_IN.3 99.95,78.36 82.55,78.36 | v50.8,50.8 51.69,49.91 v66.42,49.91 77.85,49.91 82.55,54.61 82.55,78.36 | 82.55,78.36 C11.+
+5V  (via drill 0.41)
  Top 0.203: IC3.80 71.31,32.26 R15.2
  Top 0.254: C22.1 79.01,17.51 | IC3.10 59.33,21.84 61.31,21.84 | 61.31,21.84 61.31,19.34 63.81,19.34 | 61.31,21.84 IC3.100 61.31,34.19 58.29,37.21 53.72,37.21 ICSP.2 | 71.31,19.34 74.89,19.34 74.93,19.3 75.29,19.3 IC3.61 75.33,19.3 78.99,19.3 | 71.31,19.34 63.81,19.34 | 63.81,19.34 IC3.31 | IC3.80 71.31,19.34 | R38.2 72.08,46.67 73.09,45.66 74.74,45.66 75.75,46.67 76.03,46.67 | R35.2 64.59,46.67 65.47,45.79 67.23,45.79 Q9.1 | R36.2 56.97,46.67 57.85,45.79 59.76,45.79 60.64,46.67 60.79,46.67
  Top 0.508: SD_SOCKET.5 21.59,29.34 36.96,13.97 DISPLAY_CONN.10 40.01,10.79 40.01,8.26 40.64,7.62 R10.2 42.23,5.93 D2.C | R36.2 53.17,46.67 Q6.1 | R35.2 60.79,46.67 Q7.1 | R38.2 68.41,46.67 Q9.1 | Q8.1 76.03,46.67 R37.2 84.14,46.67 v84.2,46.61 | C24.1 C23.1 C22.1 78.99,17.8 78.99,19.3 84.07,19.3 87.63,22.86 87.63,30.48 | R14.1 90.49,35.88 OK1.8 90.17,34.29 87.63,31.75 87.63,30.48 | R15.2 R16.2 | 87.63,30.48 97.79,30.48 109.22,41.91 POWER_IN.2
  Bottom 0.305: OUTPUT_CONN.4 OUTPUT_CONN.6 50.8,93.98 109.22,93.98 POWER_IN.2
  Bottom 0.508: SD_SOCKET.6 SD_SOCKET.5 | DISPLAY_CONN.10 45.72,11.43 45.72,7.62 46.99,6.35 74.93,6.35 83.82,15.24 83.82,30.48 86.36,33.02 | 86.36,33.02 88.9,35.56 OK1.8 | 86.36,33.02 86.36,44.45 v84.2,46.61
ADC0
  Top 0.203: U$1.4 43.2,73.64 38.09,78.74 R28.2
BRD_RST_DSP  (via drill 0.41)
  Top 0.254: U$1.5 48.06,73.14 | 48.06,73.14 48.01,73.14 | 48.06,73.14 45.77,70.85
  Top 0.508: 45.77,70.85 R11.1 43.23,70.8 C45.1 S1.3 S1.4 32.31,70.41 29.21,67.31 21.59,67.31 17.78,63.5 SV2.6 | Q6.2 55.88,51.58 v55.88,60.96
  Bottom 0.508: v55.88,60.96 52.07,60.96 45.72,67.31 41.91,67.31 38.81,70.41 S1.3
CM
  Top 0.203: U$1.40 55.86,79.69 56.19,80.01 58.15,80.01 C12.1
  Top 0.508: C13.+ 62.23,87.25 62.23,82.55 61.23,81.55 C12.1
DSP_OUT_CH1
  Top 0.203: U$1.46 52.86,79.47 51.31,81.03 51.31,89.15 49.91,90.55 45.72,90.55 44.45,91.82 OUTPUT_CONN.1
DSP_OUT_CH2
  Top 0.203: U$1.45 53.36,79.74 52.07,81.03 52.07,89.28 49.53,91.82 OUTPUT_CONN.5
DSP_OUT_CH3
  Top 0.203: U$1.44 53.86,80 52.7,81.15 52.7,89.28 54.61,91.19 OUTPUT_CONN.9
DSP_OUT_CH4
  Top 0.203: OUTPUT_CONN.13 59.69,91.44 58.42,90.17 54.48,90.17 53.47,89.15 53.47,81.15 54.36,80.26 U$1.43
FILTA
  Top 0.203: C15.1 49.25,81.28 51.93,78.6 52.27,78.27 52.36,78.17 U$1.47
  Top 0.508: C15.1 46.72,84.98 C16.+
FILTD
  Top 0.203: C1.1 55.36,79.76 U$1.41
  Top 0.508: C2.+ 54.61,87.25 54.61,82.55 55.61,81.55 C1.1
GND  (via drill 0.41)
  Top 0.203: 71.12,73.66 71.1,73.64 | 71.1,73.64 69.17,73.64 68.49,74.32 63.59,74.32 62.91,73.64 U$1.33 57.77,73.64 57.66,73.53 | C18.1 71.1,73.41 71.1,73.64 | IC3.11 57.42,21.32 v57.28,21.46 | IC3.99 61.81,29.81 62.36,30.35 | 62.36,30.35 v62.48,30.48 | IC3.81 70.77,28.36 70.77,29.2 69.61,30.35 62.36,30.35 | U$1.42 v54.86,74.55 | C15.2 44.72,80.28 U$1.1 | S1.1 47.81,66.32 49.86,68.37 U$1.12 51.86,69.64 52.07,69.85 52.07,71.88 51.81,72.14 U$1.7 | U$1.38 56.86,78.58 56.9,78.61 57.02,78.61 57.15,78.74 57.4,78.74 57.36,78.7 U$1.37 | U$1.25 57.74,69.64 57.66,69.72 | U$1.30 57.66,72.14 | IC3.62 75.27,19.86 74.44,19.86 73.6,20.7 73.53,20.7 73.53,20.45 73.66,20.32 | IC3.32 64.31,10.72 61.85,8.26 61.85,2.16 62.48,1.52 64.64,1.52 65.02,1.91 Y1.2 65.02,2.79
  Top 0.254: C22.2 80.86,17.63
  Top 0.508: C11.- 76.31,76.58 C8.2 | C8.2 C6.2 C5.2 71.12,73.66 C18.1 | C8.2 C17.1 | C16.- 44.83,81.39 C15.2 | R2.1 16.78,81.28 C44.2 C42.2 14.97,84.09 14.92,84.14 R27.1 R29.1 7.94,80.96 | C7.2 51.07,57.26 C3.- | 65.41,63.5 IC1.1 | 65.41,63.5 73.66,63.5 76.2,60.96 JP4.3 75.93,58.15 C14.2 | 65.41,63.5 64.14,63.5 | 64.14,63.5 IC1.2 | 64.14,63.5 62.87,63.5 | 62.87,63.5 IC1.3 | 62.87,63.5 61.59,63.5 IC1.4 | C4.- 43.45,57.26 C9.2 43.45,62.23 | 43.45,62.23 C10.2 | SV2.10 43.45,62.23 | R13.1 97.79,41.59 OK1.5 | C22.2 C23.2 C24.2 | S2.3 S2.4 47.32,12.19 42.67,12.19 42.18,11.7 C25.2 | C12.2 C1.2 57.15,87.25 C2.- C13.- 60.07,83.93 C12.2
  Bottom 0.203: v57.28,28.7 v57.28,21.46
  Bottom 0.508: SD_SOCKET.16 SD_SOCKET.15 | SD_SOCKET.2 SD_SOCKET.1
  pour Bottom (isolate 0.508): 0,0 130,0 130,100 0,100
  pour Top (isolate 0.508): 0,0 130,0 130,100 0,100
N$1
  Top 0.203: U$1.3 45.11,74.14 38.09,81.15 35.37,81.15 R2.2
N$2
  Top 0.203: 48.03,52.32 48.03,63.27 48.9,64.14 52.96,64.14 53.86,65.04 U$1.17
  Top 0.305: R1.1 40.64,45.21 41.4,44.45 47.62,44.45 48.51,45.34 48.51,51.84 48.03,52.32
  Top 0.508: T1.1 48.03,52.32 48.03,52.07
N$3
  Top 0.203: U$1.35 62.21,74.64 63.63,76.06
  Top 0.508: C19.2 C20.2 63.63,76.06
N$4
  Top 0.406: OUTPUT_CONN.8 54.61,97.79 115.57,97.79 116.84,96.52 116.84,33.02 111.76,27.94 R8.1
N$5
  Top 0.508: C20.1 68.26,76.2 R7.2
N$6
  Top 0.508: 71.25,71.26 Q1.2 | 71.25,71.26 C18.2 | 71.25,71.26 69.39,71.26 68.26,72.39 R6.2
N$7
  Top 0.203: C17.2 75.2,72.39 69.6,72.39 68.2,73.79 63.88,73.79 63.23,73.14 U$1.32
  Top 0.508: Q1.1 76.2,67.44 C17.2
N$8
  Top 0.203: U$1.31 64.84,72.64 R6.1
N$9
  Top 0.406: R8.2 LED1.A
N$10
  Bottom 0.406: OUTPUT_CONN.10 57.15,97.79 115.57,97.79 119.38,93.98 JP2.2
N$11
  Top 0.254: IC3.3 54.69,25.32 JP3.1
N$12
  Top 0.254: IC3.2 58,25.82 55.88,27.94 JP3.2
N$13
  Top 0.254: R12.2 93.98,21.27 93.98,23.63 96.51,26.16 96.52,26.16 96.52,29.09 96.14,29.46 93.22,29.46 92.71,28.96 OK1.2
N$15
  Top 0.508: 99.06,16.19 X8.4 99.06,16.51 95.25,20.32 R12.1 95.78,21.17 D1.C
N$16
  Top 0.254: OK1.3 95.25,25.93 D1.A
  Top 0.508: X8.5 88.9,19.58 D1.A 92.44,23.12
N$17
  Top 0.508: R13.2 95.63,41.85 95.63,40.26 96.52,39.37 96.52,34.29 95.89,33.66 93.34,33.66 92.71,34.29 OK1.7
N$30
  Top 0.508: R26.1 30.8,86.36 C46.2 C48.2
N$31
  Top 0.508: C48.1 C46.1 20.05,86.09 C42.1 16.46,86.04 R27.2 11.11,86.04 8.89,83.82 AUDIO_IN.3
N$34
  Top 0.508: C41.1 C43.1 20.05,79.01 C44.1 12.75,79.01 R29.2 12.38,78.74 AUDIO_IN.1
N$36
  Top 0.508: R28.1 C43.2 C41.2
N$40
  Top 0.203: U$1.2 46.81,74.64 38.05,83.4 35.66,83.4 R26.2
N$43
  Top 0.508: JP4.2 73.66,60.96 72.39,62.23 64.77,62.23 64.14,61.59 IC1.7
PB0
  Top 0.254: IC3.19 56.34,17.32 55.88,17.78 36.83,17.78 24.13,30.48 SD_SOCKET.7
PB1  (via drill 0.41)
  Top 0.254: IC3.20 54.95,16.82 54.8,16.97 46.18,16.97 44.45,15.24 39.37,15.24 v38.1,16.51
  Top 0.406: DISPLAY_CONN.5 39.37,26.67 29.21,36.83 SD_SOCKET.11
  Bottom 0.254: v38.1,16.51 38.1,24.13 40.64,26.67 DISPLAY_CONN.5
  Bottom 0.406: DISPLAY_CONN.5 46.99,26.67 50.8,30.48 53.34,30.48 54.61,31.75 ICSP.3
  Bottom 0.508: SD_SOCKET.12 SD_SOCKET.11
PB2  (via drill 0.41)
  Top 0.254: IC3.21 46.8,16.32 v45.72,15.24
  Bottom 0.254: v45.72,15.24 37.47,15.24 36.32,16.38 36.32,26.16 39.37,29.21 | DISPLAY_CONN.4 39.37,29.21 | 39.37,29.21 26.67,41.91 SD_SOCKET.9
  Bottom 0.406: DISPLAY_CONN.4 46.99,29.21 49.53,31.75 49.53,36.83 50.8,38.1 53.34,38.1 54.61,36.83 ICSP.4
  Bottom 0.508: SD_SOCKET.10 SD_SOCKET.9
PB3  (via drill 0.41)
  Top 0.254: IC3.22 61.54,15.82 62.23,16.51 v62.23,18.29
  Top 0.406: SD_SOCKET.13 31.75,36.83 35.56,33.02 ICSP.1
  Bottom 0.254: v62.23,18.29 62.23,25.4 55.88,31.75 55.88,33.31 54.9,34.29 52.7,34.29 51.94,33.53 52.07,33.4 ICSP.1
  Bottom 0.508: SD_SOCKET.14 SD_SOCKET.13
PE  (1 unrouted)
PE4
  Top 0.254: DISPLAY_CONN.3 44.45,31.75 52.38,23.82 IC3.6
PH6
  Top 0.254: IC3.18 57.11,17.82 54.61,20.32 36.83,20.32 25.4,31.75 25.4,46.99 SD_SOCKET.8
PL0  (via drill 0.41)
  Top 0.254: IC3.35 65.81,15.34 v65.15,16
  Bottom 0.254: DISPLAY_CONN.7 50.8,21.59 56.39,16 v65.15,16
PL1  (via drill 0.41)
  Top 0.254: IC3.36 66.31,17.13 v66.29,17.14
  Bottom 0.254: DISPLAY_CONN.6 49.53,24.13 56.52,17.14 v66.29,17.14
PL2  (via drill 0.41)
  Top 0.254: 66.81,12.7 IC3.37 66.83,12.34 66.83,13.59 67.44,14.2 v67.44,14.99
  Bottom 0.254: DISPLAY_CONN.8 52.07,19.05 56.13,14.99 v67.44,14.99
PL5
  Top 0.254: JP2.1 115.57,8.89 103.92,8.89 102.65,10.16 100.33,10.16 99.06,8.89 88.9,8.89 87.63,10.16 85.09,10.16 83.82,8.89 68.58,8.89 68.31,9.16 IC3.40
PL6  (via drill 0.41)
  Top 0.254: IC3.41 68.81,15.22 67.31,16.72 v67.31,17.78
  Bottom 0.508: JP1.1 v67.31,17.78
PL6_5V_DSP
  Top 0.508: Q7.3 63.35,44.62 R35.1 63.5,43.18 64.77,41.91 68.58,41.91 JP1.4
PL7  (via drill 0.41)
  Top 0.254: IC3.42 69.31,15.78 68.58,16.51 v68.58,17.78
  Bottom 0.508: JP1.3 69.85,36.83 68.58,35.56 v68.58,17.78
PL7_5V_DSP
  Top 0.508: Q6.3 52.22,44.77 R36.1 60.01,40.64 JP1.2
RESET  (via drill 0.41)
  Top 0.203: ICSP.5 57.15,31.75 55.24,29.84 52.7,29.84 v50.8,27.94
  Top 0.254: IC3.30 63.31,10.86 61.62,9.17 S2.1
  Top 0.508: 48.82,9.02 S2.2 48.54,8.89 44.18,8.89 | C25.1 44.18,8.89 | 44.18,8.89 44.18,7.57 R10.1 44.13,5.93 D2.A
  Bottom 0.203: v50.8,27.94 48.06,25.2 41.21,25.2 40.59,24.57 40.59,18.48 41.34,17.73 50.85,17.73 52.07,16.51 52.07,9.17 | S2.1 52.07,9.17 | 52.07,9.17 S2.2
RXD3
  Top 0.305: IC3.63 82.55,20.32 86.36,24.13 86.36,41.91 86.36,43.18 87.63,44.45 91.44,44.45 92.39,43.5 R14.2
  Top 0.508: OK1.6 95.25,39.05 R14.2
SCL  (via drill 0.41)
  Top 0.254: v69.85,17.78 69.85,13.23 69.83,13.21 69.83,12.34 IC3.43 | R15.1 61.28,35.24 58.42,38.1 49.53,38.1 45.72,34.29 DISPLAY_CONN.2
  Top 0.508: JP1.5 R15.1
  Bottom 0.508: JP1.5 72.39,36.83 69.85,34.29 v69.85,17.78
SCL_5V_DSP
  Top 0.254: JP1.6 72.9,40.64 74.17,39.37 77.47,39.37 78.74,40.64 78.74,44.45
  Top 0.508: Q8.3 78.57,44.62 78.74,44.45 R37.1
SCL_DSP  (via drill 0.41)
  Top 0.203: IC1.6 62.87,60.83 62.23,61.47 61.59,61.47 56.86,66.2 U$1.23
  Top 0.508: IC1.6 v62.87,57.15 64.77,57.15 65.72,56.2 R4.1 66.67,55.24 67.31,54.61 67.31,50.8 68.58,49.53 71.27,49.53 Q8.2
  Bottom 0.508: SV2.1 17.78,54.61 62.23,54.61 62.87,55.24 v62.87,57.15
SDA  (via drill 0.41)
  Top 0.254: IC3.44 70.31,15.75 71.12,16.56 v71.12,17.78 | JP1.7 74.37,38.1 73.08,39.4 71.7,39.4 71.14,38.84 71.14,36.53 70.53,35.92 61.89,35.92 58.74,39.06 49.23,39.06 46.99,36.83 DISPLAY_CONN.1
  Top 0.508: JP1.7 R16.1
  Bottom 0.508: JP1.7 74.93,36.83 71.12,33.02 v71.12,17.78
SDA_5V_DSP
  Top 0.508: Q9.3 70.97,44.62 R38.1 74.93,40.96 JP1.8
SDA_DSP  (via drill 0.41)
  Top 0.203: IC1.5 61.59,60.33 56.36,65.56 U$1.22
  Top 0.508: IC1.5 v61.59,55.88 61.59,54.3 R5.1 63.82,50.8 66.36,48.26 Q9.2
  Bottom 0.508: SV2.3 19.05,55.88 v61.59,55.88
WP_DSP  (via drill 0.41)
  Top 0.203: U$1.21 55.86,64.79 v59.69,60.96
  Top 0.508: R3.1 71.12,52.39 JP4.1 | v58.8,53.34 58.8,46.88 Q7.2
  Bottom 0.203: v59.69,60.96 68.58,60.96 JP4.1
  Bottom 0.508: JP4.1 67.31,58.42 62.23,53.34 v58.8,53.34
XTAL1
  Top 0.254: Y1.3 66.02,7.6 R9.1 65.87,9.6 65.31,10.16 IC3.34
XTAL2
  Top 0.254: Y1.1 64.02,7.6 R9.2 64.17,9.56 64.81,10.2 IC3.33

### Text on the board
Top: Teslacontroller Mainboard / by Michael Loose@FHWS / Rev 1.0 05/19